# Altium project Simulator_PCB.PrjPcb
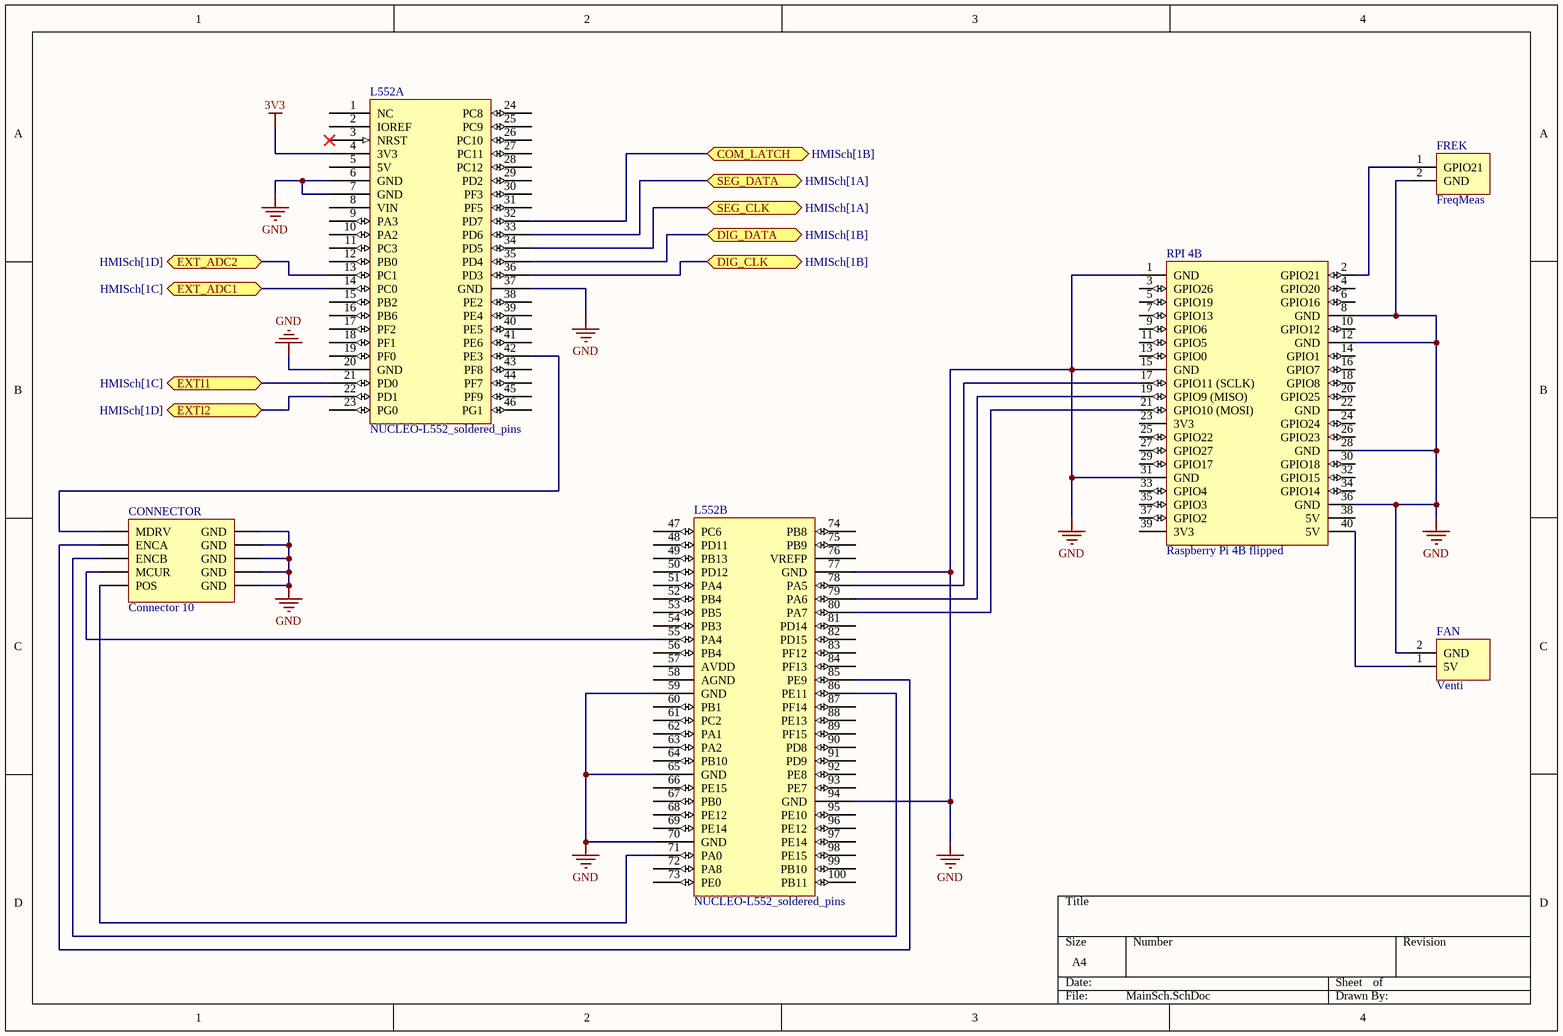
[diagram p0: MainSch.SchDoc]
2 sheets, 37 parts. Net scope: flat (ports and power ports of the same name join across sheets).
Board file: RobonAUT_PCB.PcbDoc
Sheets:
  MainSch.SchDoc
  HMISch.SchDoc

## Sheet MainSch.SchDoc
size A4; SheetNumber: 1; SheetTotal: 2

### Parts
CONNECTOR  Connector 10  [CONNECTOR-10P]
FAN  Venti  [FP_CONN2_TUSKE_254MM]
FREK  FreqMeas  [FP_CONN2_TUSKE_254MM]
L552  NUCLEO-L552_soldered_pins  [FP_NUCLEO-144 inner connector]  (parts A,B of 2)
RPI_4B  Raspberry Pi 4B flipped  [Raspberry Pi 4B flipped]

### Ports
COM_LATCH (bidir, see HMISch[1B]), DIG_CLK (bidir, see HMISch[1B]), DIG_DATA (bidir, see HMISch[1B]), EXT_ADC1 (bidir, see HMISch[1C]), EXT_ADC2 (bidir, see HMISch[1D]), EXTI1 (bidir, see HMISch[1C]), EXTI2 (bidir, see HMISch[1D]), SEG_CLK (bidir, see HMISch[1A]), SEG_DATA (bidir, see HMISch[1A])

### Nets
3V3: L552.4(3V3)
GND: CONNECTOR.2(GND) CONNECTOR.4(GND) CONNECTOR.6(GND) CONNECTOR.8(GND) CONNECTOR.10(GND) FAN.2(GND) FREK.2(GND) L552.6(GND) L552.7(GND) L552.20(GND) L552.37(GND) L552.59(GND) L552.65(GND) L552.70(GND) L552.77(GND) L552.94(GND) RPI_4B.1(GND) RPI_4B.8(GND) RPI_4B.12(GND) RPI_4B.15(GND) RPI_4B.28(GND) RPI_4B.31(GND) RPI_4B.36(GND)
NetCONNECTOR_1: CONNECTOR.1(MDRV) L552.42(PE3)
NetCONNECTOR_3: CONNECTOR.3(ENCA) L552.85(PE9)
NetCONNECTOR_5: CONNECTOR.5(ENCB) L552.86(PE11)
NetCONNECTOR_7: CONNECTOR.7(MCUR) L552.55(PA4)
NetCONNECTOR_9: CONNECTOR.9(POS) L552.71(PA0)
NetEXTI1_BUTTON_1: L552.21(PD0) ; port EXTI1
NetEXTI2_BUTTON_1: L552.22(PD1) ; port EXTI2
NetFAN_1: FAN.1(5V) RPI_4B.40(5V)
NetFREK_1: FREK.1(GPIO21) RPI_4B.2(GPIO21)
NetL552_13: L552.13(PC1) ; port EXT_ADC2
NetL552_14: L552.14(PC0) ; port EXT_ADC1
NetL552_32: L552.32(PD7) ; port COM_LATCH
NetL552_33: L552.33(PD6) ; port SEG_DATA
NetL552_34: L552.34(PD5) ; port SEG_CLK
NetL552_35: L552.35(PD4) ; port DIG_DATA
NetL552_36: L552.36(PD3) ; port DIG_CLK
NetL552_78: L552.78(PA5) RPI_4B.17(GPIO11_(SCLK))
NetL552_79: L552.79(PA6) RPI_4B.19(GPIO9_(MISO))
NetL552_80: L552.80(PA7) RPI_4B.21(GPIO10_(MOSI))

Not connected (* = marked no-connect by the designer): L552 1(NC) 2(IOREF) 3(NRST)* 5(5V) 8(VIN) 9(PA3) 10(PA2) 11(PC3) 12(PB0) 15(PB2) 16(PB6) 17(PF2) 18(PF1) 19(PF0) 23(PG0) 24(PC8) 25(PC9) 26(PC10) 27(PC11) 28(PC12) 29(PD2) 30(PF3) 31(PF5) 38(PE2) 39(PE4) 40(PE5) 41(PE6) 43(PF8) 44(PF7) 45(PF9) 46(PG1) 47(PC6) 48(PD11) 49(PB13) 50(PD12) 51(PA4) 52(PB4) 53(PB5) 54(PB3) 56(PB4) 57(AVDD) 58(AGND) 60(PB1) 61(PC2) 62(PA1) 63(PA2) 64(PB10) 66(PE15) 67(PB0) 68(PE12) 69(PE14) 72(PA8) 73(PE0) 74(PB8) 75(PB9) 76(VREFP) 81(PD14) 82(PD15) 83(PF12) 84(PF13) 87(PF14) 88(PE13) 89(PF15) 90(PD8) 91(PD9) 92(PE8) 93(PE7) 95(PE10) 96(PE12) 97(PE14) 98(PE15) 99(PB10) 100(PB11); RPI_4B 3(GPIO26) 4(GPIO20) 5(GPIO19) 6(GPIO16) 7(GPIO13) 9(GPIO6) 10(GPIO12) 11(GPIO5) 13(GPIO0) 14(GPIO1) 16(GPIO7) 18(GPIO8) 20(GPIO25) 22(GND) 23(3V3) 24(GPIO24) 25(GPIO22) 26(GPIO23) 27(GPIO27) 29(GPIO17) 30(GPIO18) 32(GPIO15) 33(GPIO4) 34(GPIO14) 35(GPIO3) 37(GPIO2) 38(5V) 39(3V3)

### Library data of the parts
CONNECTOR = Connector 10 spec: Special 10 pin ribbon connector; Reference: *; Supplier: *; Name: *
FAN FREK = Connector_2pin: 2pin connector
L552 = NUCLEO-L552_inner: https://www.st.com/resource/en/user_manual/um2581-stm32l5-nucleo144-board-mb1361-stmicroelectronics.pdf

## Sheet HMISch.SchDoc
size A4; SheetNumber: 2; SheetTotal: 2
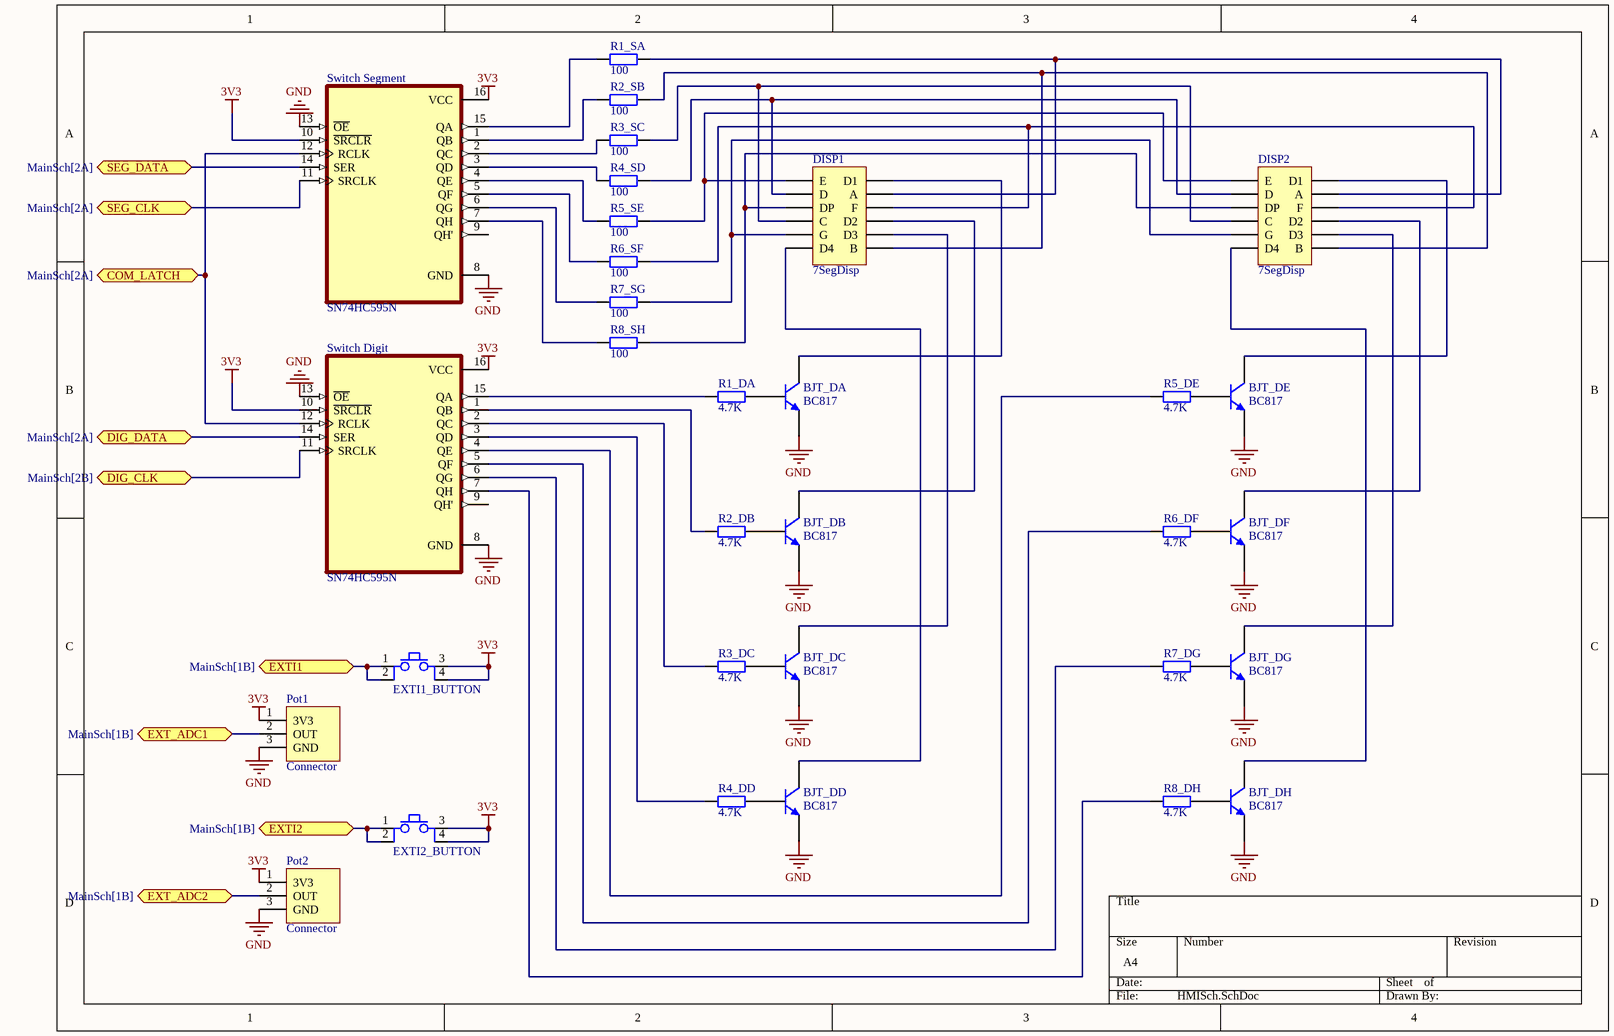
[diagram p1: HMISch.SchDoc]

### Parts
BJT_DA  BC817  [FP_SOT23-3]
BJT_DB  BC817  [FP_SOT23-3]
BJT_DC  BC817  [FP_SOT23-3]
BJT_DD  BC817  [FP_SOT23-3]
BJT_DE  BC817  [FP_SOT23-3]
BJT_DF  BC817  [FP_SOT23-3]
BJT_DG  BC817  [FP_SOT23-3]
BJT_DH  BC817  [FP_SOT23-3]
DISP1  7SegDisp  [3461AS_FP]
DISP2  7SegDisp  [3461AS_FP]
EXTI1_BUTTON  Button  [FP_BTN_SMD]  (value not drawn)
EXTI2_BUTTON  Button  [FP_BTN_SMD]  (value not drawn)
Pot1  Connector  [Potmeter_3C_FP]
Pot2  Connector  [Potmeter_3C_FP]
R1_DA  4.7K  [FP_1206_RES]
R1_SA  100  [FP_1206_RES]
R2_DB  4.7K  [FP_1206_RES]
R2_SB  100  [FP_1206_RES]
R3_DC  4.7K  [FP_1206_RES]
R3_SC  100  [FP_1206_RES]
R4_DD  4.7K  [FP_1206_RES]
R4_SD  100  [FP_1206_RES]
R5_DE  4.7K  [FP_1206_RES]
R5_SE  100  [FP_1206_RES]
R6_DF  4.7K  [FP_1206_RES]
R6_SF  100  [FP_1206_RES]
R7_DG  4.7K  [FP_1206_RES]
R7_SG  100  [FP_1206_RES]
R8_DH  4.7K  [FP_1206_RES]
R8_SH  100  [FP_1206_RES]
Switch_Digit  SN74HC595N  [DIP794W45P254L1969H508Q16]
Switch_Segment  SN74HC595N  [DIP794W45P254L1969H508Q16]

### Ports
COM_LATCH (bidir, see MainSch[2A]), DIG_CLK (bidir, see MainSch[2B]), DIG_DATA (bidir, see MainSch[2A]), EXT_ADC1 (bidir, see MainSch[1B]), EXT_ADC2 (bidir, see MainSch[1B]), EXTI1 (bidir, see MainSch[1B]), EXTI2 (bidir, see MainSch[1B]), SEG_CLK (bidir, see MainSch[2A]), SEG_DATA (bidir, see MainSch[2A])

### Nets
3V3: EXTI1_BUTTON.3 EXTI1_BUTTON.4 EXTI2_BUTTON.3 EXTI2_BUTTON.4 Pot1.1(3V3) Pot2.1(3V3) Switch_Digit.10(~{SRCLR}) Switch_Digit.16(VCC) Switch_Segment.10(~{SRCLR}) Switch_Segment.16(VCC)
GND: BJT_DA.2(E) BJT_DB.2(E) BJT_DC.2(E) BJT_DD.2(E) BJT_DE.2(E) BJT_DF.2(E) BJT_DG.2(E) BJT_DH.2(E) Pot1.3(GND) Pot2.3(GND) Switch_Digit.8(GND) Switch_Digit.13(~{OE}) Switch_Segment.8(GND) Switch_Segment.13(~{OE})
NetBJT_DA_1: BJT_DA.1(B) R1_DA.2
NetBJT_DA_3: BJT_DA.3(C) DISP1.2(D1)
NetBJT_DB_1: BJT_DB.1(B) R2_DB.2
NetBJT_DB_3: BJT_DB.3(C) DISP1.8(D2)
NetBJT_DC_1: BJT_DC.1(B) R3_DC.2
NetBJT_DC_3: BJT_DC.3(C) DISP1.10(D3)
NetBJT_DD_1: BJT_DD.1(B) R4_DD.2
NetBJT_DD_3: BJT_DD.3(C) DISP1.11(D4)
NetBJT_DE_1: BJT_DE.1(B) R5_DE.2
NetBJT_DE_3: BJT_DE.3(C) DISP2.2(D1)
NetBJT_DF_1: BJT_DF.1(B) R6_DF.2
NetBJT_DF_3: BJT_DF.3(C) DISP2.8(D2)
NetBJT_DG_1: BJT_DG.1(B) R7_DG.2
NetBJT_DG_3: BJT_DG.3(C) DISP2.10(D3)
NetBJT_DH_1: BJT_DH.1(B) R8_DH.2
NetBJT_DH_3: BJT_DH.3(C) DISP2.11(D4)
NetDISP1_1: DISP1.1(E) DISP2.1(E) R5_SE.2
NetDISP1_3: DISP1.3(D) DISP2.3(D) R4_SD.2
NetDISP1_4: DISP1.4(A) DISP2.4(A) R1_SA.2
NetDISP1_5: DISP1.5(DP) DISP2.5(DP) R8_SH.2
NetDISP1_6: DISP1.6(F) DISP2.6(F) R6_SF.2
NetDISP1_7: DISP1.7(C) DISP2.7(C) R3_SC.2
NetDISP1_9: DISP1.9(G) DISP2.9(G) R7_SG.2
NetDISP1_12: DISP1.12(B) DISP2.12(B) R2_SB.2
NetEXTI1_BUTTON_1: EXTI1_BUTTON.1 EXTI1_BUTTON.2 ; port EXTI1
NetEXTI2_BUTTON_1: EXTI2_BUTTON.1 EXTI2_BUTTON.2 ; port EXTI2
NetL552_13: Pot2.2(OUT) ; port EXT_ADC2
NetL552_14: Pot1.2(OUT) ; port EXT_ADC1
NetL552_32: Switch_Digit.12(RCLK) Switch_Segment.12(RCLK) ; port COM_LATCH
NetL552_33: Switch_Segment.14(SER) ; port SEG_DATA
NetL552_34: Switch_Segment.11(SRCLK) ; port SEG_CLK
NetL552_35: Switch_Digit.14(SER) ; port DIG_DATA
NetL552_36: Switch_Digit.11(SRCLK) ; port DIG_CLK
NetR1_DA_1: R1_DA.1 Switch_Digit.15(QA)
NetR1_SA_1: R1_SA.1 Switch_Segment.15(QA)
NetR2_DB_1: R2_DB.1 Switch_Digit.1(QB)
NetR2_SB_1: R2_SB.1 Switch_Segment.1(QB)
NetR3_DC_1: R3_DC.1 Switch_Digit.2(QC)
NetR3_SC_1: R3_SC.1 Switch_Segment.2(QC)
NetR4_DD_1: R4_DD.1 Switch_Digit.3(QD)
NetR4_SD_1: R4_SD.1 Switch_Segment.3(QD)
NetR5_DE_1: R5_DE.1 Switch_Digit.4(QE)
NetR5_SE_1: R5_SE.1 Switch_Segment.4(QE)
NetR6_DF_1: R6_DF.1 Switch_Digit.5(QF)
NetR6_SF_1: R6_SF.1 Switch_Segment.5(QF)
NetR7_DG_1: R7_DG.1 Switch_Digit.6(QG)
NetR7_SG_1: R7_SG.1 Switch_Segment.6(QG)
NetR8_DH_1: R8_DH.1 Switch_Digit.7(QH)
NetR8_SH_1: R8_SH.1 Switch_Segment.7(QH)

Not connected (* = marked no-connect by the designer): Switch_Digit 9(QH'); Switch_Segment 9(QH')

### Library data of the parts
BJT_DA BJT_DB BJT_DC BJT_DD BJT_DE BJT_DF BJT_DG BJT_DH = BC817: NPN General-purpose Transistor; ComponentLink1Description: Manufacturer Link; ComponentLink1URL: http://www.semiconductors.philips.com/; ComponentLink2Description: Datasheet; ComponentLink2URL: http://www.semiconductors.philips.com/acrobat/datasheets/BC817_BC817W_BC337_5.pdf
DISP1 DISP2 = 3461AS: 7 segment display sch; Reference: *; Supplier: *; Name: *
EXTI1_BUTTON EXTI2_BUTTON = Button 4P: Push button
Pot1 Pot2 = Potmeter_3pin: 3pin connector
R1_DA R1_SA R2_DB R2_SB R3_DC R3_SC R4_DD R4_SD R5_DE R5_SE R6_DF R6_SF R7_DG R7_SG R8_DH R8_SH = RES: Resistor
  R1_DA R2_DB R3_DC R4_DD R5_DE R6_DF R7_DG R8_DH: Value: 4.7K
  R1_SA R2_SB R3_SC R4_SD R5_SE R6_SF R7_SG R8_SH: Value: 100
Switch_Digit Switch_Segment = SN74HC595N: Package: None; Price: None; Availability: Unavailable; MP: SN74HC595N; Value: *

## Nets that join several sheets
3V3: MainSch (L552.4), HMISch (10 pins)
GND: MainSch (23 pins), HMISch (14 pins)
NetEXTI1_BUTTON_1: MainSch (L552.21), HMISch (EXTI1_BUTTON.1 EXTI1_BUTTON.2)
NetEXTI2_BUTTON_1: MainSch (L552.22), HMISch (EXTI2_BUTTON.1 EXTI2_BUTTON.2)
NetL552_13: MainSch (L552.13), HMISch (Pot2.2)
NetL552_14: MainSch (L552.14), HMISch (Pot1.2)
NetL552_32: MainSch (L552.32), HMISch (Switch_Digit.12 Switch_Segment.12)
NetL552_33: MainSch (L552.33), HMISch (Switch_Segment.14)
NetL552_34: MainSch (L552.34), HMISch (Switch_Segment.11)
NetL552_35: MainSch (L552.35), HMISch (Switch_Digit.14)
NetL552_36: MainSch (L552.36), HMISch (Switch_Digit.11)